# EAGLE design FluoShield (EAGLE 7.1.0)
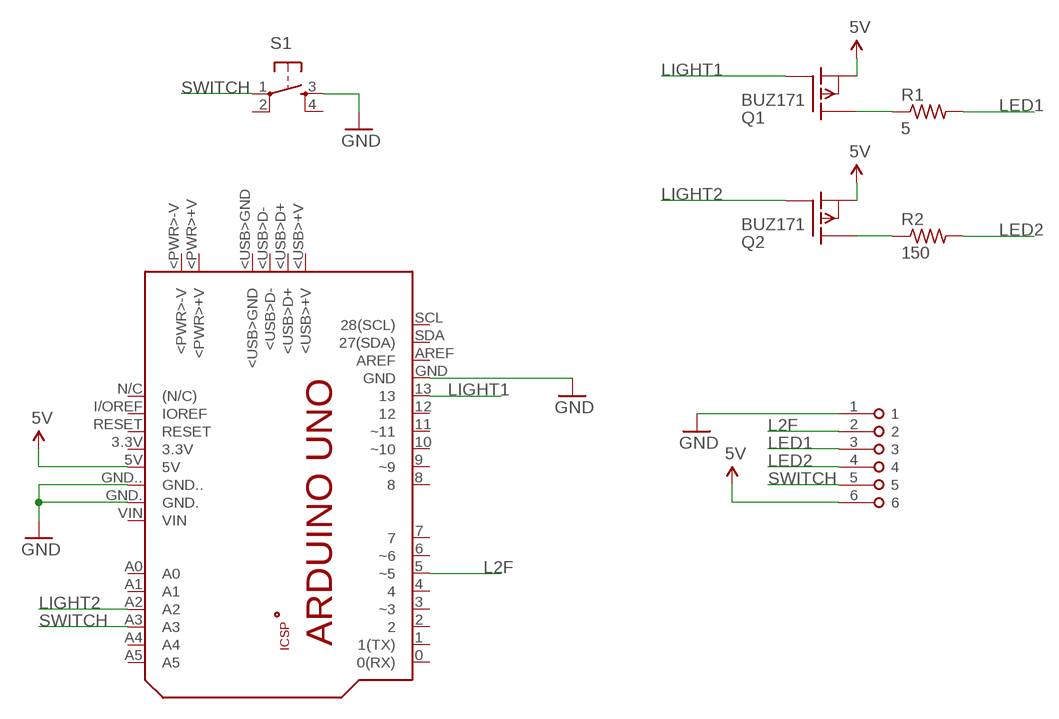
[diagram p0: schematic, sheet 1]

## Parts
PCB1  ARDUINO_UNO  [ARDUINO_UNO]
Q1  BUZ171  [TO220]
Q2  BUZ171  [TO220]
R1  5  R-US_0207/10  [0207/10]
R2  150  R-US_0207/10  [0207/10]
S1  TAC_SWITCHPTH  [TACTILE-PTH]
U$4  TERMINAL-6  [MBE-156]

## Nets
5V: PCB1.5V Q1.3(S) Q2.3(S) U$4.6
GND: PCB1.GND PCB1.GND. PCB1.GND.. S1.3 U$4.1
L2F: PCB1.5(~5) U$4.2
LED1: R1.2 U$4.3
LED2: R2.2 U$4.4
LIGHT1: PCB1.13 Q1.1(G)
LIGHT2: PCB1.A2 Q2.1(G)
N$1: Q1.2(D) R1.1
N$2: Q2.2(D) R2.1
SWITCH: PCB1.A3 S1.1 U$4.5
Unconnected: PCB1.0(0(RX)) PCB1.1(1(TX)) PCB1.2 PCB1.3(~3) PCB1.3.3V PCB1.4 PCB1.6(~6) PCB1.7 PCB1.8 PCB1.9(~9) PCB1.10(~10) PCB1.11(~11) PCB1.12 PCB1.+5V PCB1.<PWR>+V PCB1.<PWR>-V PCB1.<USB>+V PCB1.<USB>D+ PCB1.<USB>D- PCB1.<USB>GND PCB1.A0 PCB1.A1 PCB1.A4 PCB1.A5 PCB1.AREF PCB1.GND_ PCB1.I/OREF(IOREF) PCB1.MISO PCB1.MOSI PCB1.N/C((N/C)) PCB1.RESET PCB1.RESET. PCB1.SCK PCB1.SCL(28(SCL)) PCB1.SDA(27(SDA)) PCB1.VIN S1.2 S1.4

## Library data of the parts
PCB1 = E14_Arduino:ARDUINO_UNO: Device for representing an Arduino Uno board with a footprint in an EAGLE design. Created by Dave Young for Element14. More EAGLE documentation at: http://www.element14.com/community/community/knode/cadsoft_eagle
Q1 Q2 = transistor-fet:BUZ171: P-Channel Enhancement MOSFET -50V; 7A; 0,4Ohm
R1 R2 = adafruit:R-US_: RESISTOR, American symbol
S1 = SparkFun:TAC_SWITCH: Momentary Switch Button commonly used for reset or general input. Spark Fun Electronics SKU : COM-00097
U$4 = Robin:TERMINAL-6

## Board
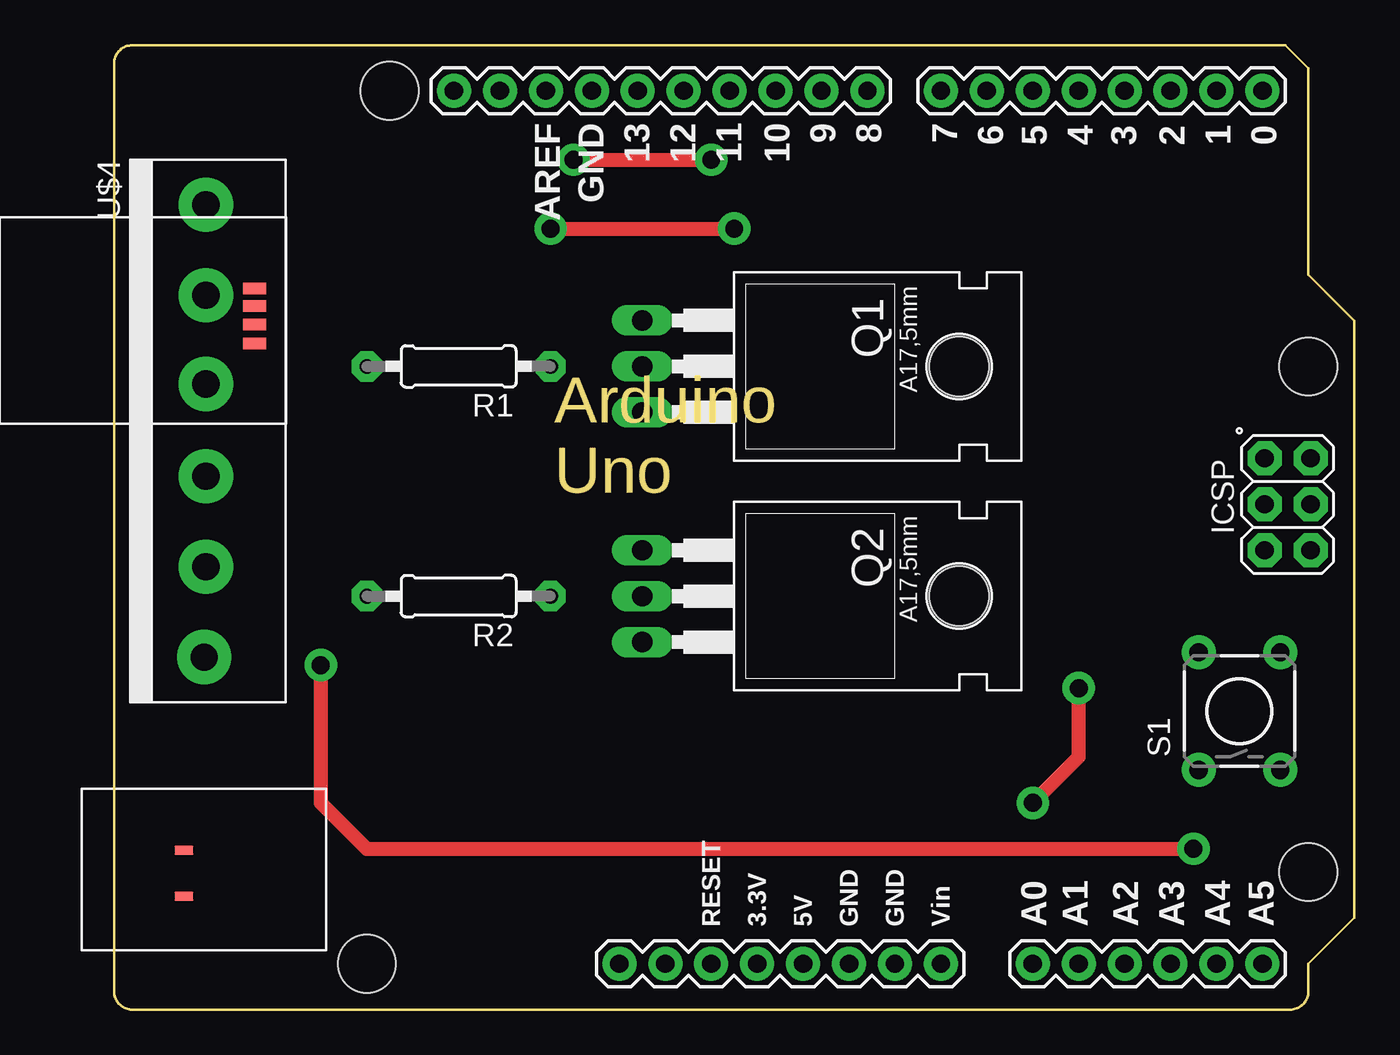
[diagram p1: board, top side]
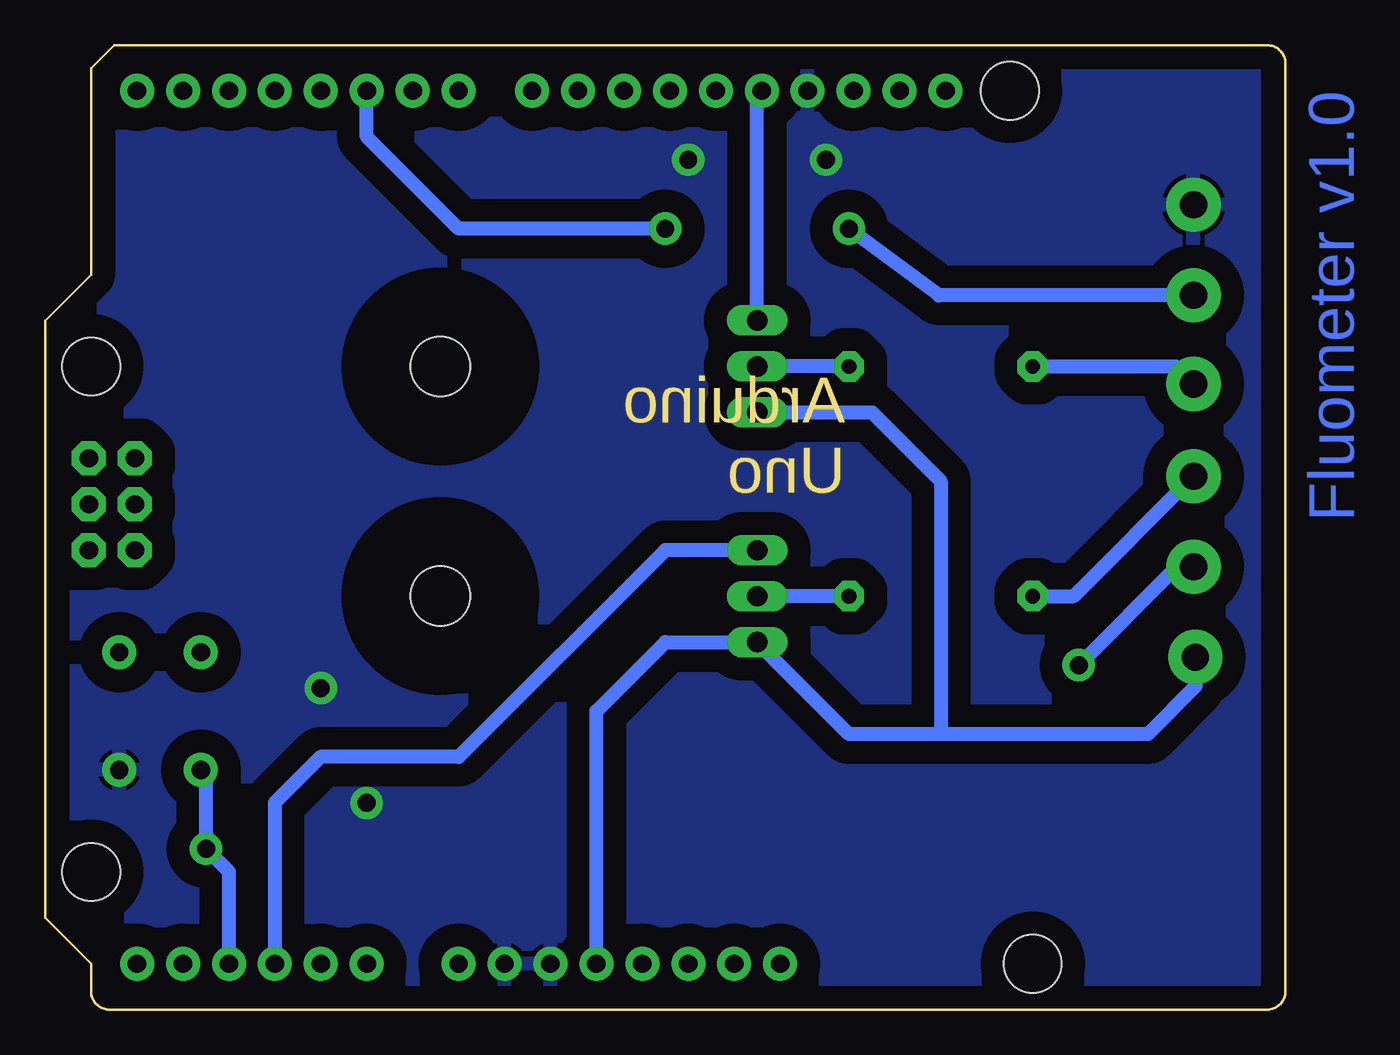
[diagram p2: board, bottom side, seen from below]

Size 68.58 x 53.31 mm. Coordinates in mm from the lower left corner, seen from the top.
Copper layers (1*16): Top 0.035mm / dielectric 1.5mm / Bottom 0.035mm
Design rules "default": minimum track width 10mil, minimum drill 24mil, track to track 8mil, track to pad 8mil, pad to pad 8mil, via to via 8mil, smd to smd 8mil, copper to edge 40mil, drill to drill 8mil, minimum pad ring 10mil, minimum via ring 8mil, stop-mask expansion 4mil, vias tented up to drill 0mil, thermal gap 10mil

### Footprints (pad centres in the part's own frame; a part is rotated, then mirrored left to right if it is on the bottom)
ARDUINO_UNO = drill 1.016 pad 1.88: 0 63.5,50.8; 1 60.96,50.8; 2 58.42,50.8; 3 55.88,50.8; 3.3V 35.56,2.54; 4 53.34,50.8; 5 50.8,50.8; 5V 38.1,2.54; 6 48.26,50.8; 7 45.72,50.8; 8 41.656,50.8; 9 39.116,50.8; 10 36.576,50.8; 11 34.036,50.8; 12 31.496,50.8; 13 28.956,50.8; A0 50.8,2.54; A1 53.34,2.54; A2 55.88,2.54; A3 58.42,2.54; A4 60.96,2.54; A5 63.5,2.54; AREF 23.876,50.8; GND 26.416,50.8; GND. 43.18,2.54; GND.. 40.64,2.54; I/OREF 30.48,2.54; N/C 27.94,2.54; RESET 33.02,2.54; SCL 18.796,50.8; SDA 21.336,50.8; VIN 45.72,2.54 | drill 1.016 pad 1.88 octagon: +5V 66.167,30.48; GND_ 66.167,25.4; MISO 63.627,30.48; MOSI 66.167,27.94; RESET. 63.627,25.4; SCK 63.627,27.94 | smd 1.016 x 0.508: <PWR>+V 3.861,8.814; <PWR>-V 3.861,6.274 | smd 1.27 x 0.635: <USB>+V 7.772,39.878; <USB>D+ 7.772,38.887; <USB>D- 7.772,37.871; <USB>GND 7.772,36.83 | hole 3.2: 66.04,7.62; 66.04,35.56; 15.24,50.8; 13.97,2.54
TO220 = drill 1.118 long: 1 -2.54,-6.35; 2 0,-6.35; 3 2.54,-6.35 | hole 3.302: 0,11.176
0207/10 = drill 0.813 pad 1.676 octagon: 1 -5.08,0; 2 5.08,0
TACTILE-PTH = drill 1.016 pad 1.88: 1 -3.251,2.261; 2 3.251,2.261; 3 -3.251,-2.261; 4 3.251,-2.261
MBE-156 = drill 1.5 pad 3: 1 2.5,0; 2 7.5,0; 3 12.4,0; 4 17.5,0; 5 22.5,0; 6 27.5,-0.1

### Placement (x,y rotation side)
PCB1  0,0 0 top
Q1  35.56,35.56 270 top
Q2  35.56,22.86 270 top
R1  19.05,35.56 180 top
R2  19.05,22.86 180 top
S1  62.23,16.51 90 top
U$4  5.08,46.99 270 top

### Tracks (layer width: path | path; a pad name or v marks a point on that pad's centre or on a via)
5V
  Bottom 0.762: PCB1.5V 38.1,16.51 34.29,20.32 Q2.3 24.13,15.24 19.05,15.24 | Q1.3 22.86,33.02 19.05,29.21 19.05,15.24 | U$4.6 4.98,17.88 7.62,15.24 19.05,15.24
GND  (via drill 0.99 pad 1.78)
  Top 0.762: v50.8,11.43 53.34,13.97 v53.34,17.78 | v25.4,46.99 v33.02,46.99
  pour Bottom (isolate 1.27): -5.08,54.61 76.2,54.61 76.2,-1.27 -5.08,-1.27
L2F  (via drill 0.99 pad 1.78)
  Top 0.762: v24.13,43.18 v34.29,43.18
  Bottom 0.762: U$4.2 19.17,39.49 v24.13,43.18 | v34.29,43.18 45.72,43.18 50.8,48.26 PCB1.5
LED1
  Bottom 0.762: R1.2 6.05,35.56 U$4.3
LED2
  Bottom 0.762: R2.2 11.71,22.86 U$4.4
LIGHT1
  Bottom 0.762: Q1.1 29.21,50.55 PCB1.13
LIGHT2
  Bottom 0.762: Q2.1 34.29,25.4 45.72,13.97 53.34,13.97 55.88,11.43 PCB1.A2
N$1
  Bottom 0.762: R1.1 Q1.2
N$2
  Bottom 0.762: R2.1 Q2.2
SWITCH  (via drill 0.99 pad 1.78)
  Top 0.762: v11.43,19.05 11.43,11.43 13.97,8.89 v59.69,8.89
  Bottom 0.762: U$4.5 5.99,24.49 v11.43,19.05 | S1.1 59.69,12.98 v59.69,8.89 58.42,7.62 PCB1.A3

### Text on the board
Bottom: Fluometer v1.0